# EasyEDA Pro project ProiectPM.eprj

# Schematic Schematic1
Board Name: Board1; Create Date: 2025-12-15; Page Name: P1; Project Name: ProiectPM; Schematic Name: Schematic1; Update Date: 2025-12-18; Company: EasyEDA.com; Page Size: A4; Version: V1.0
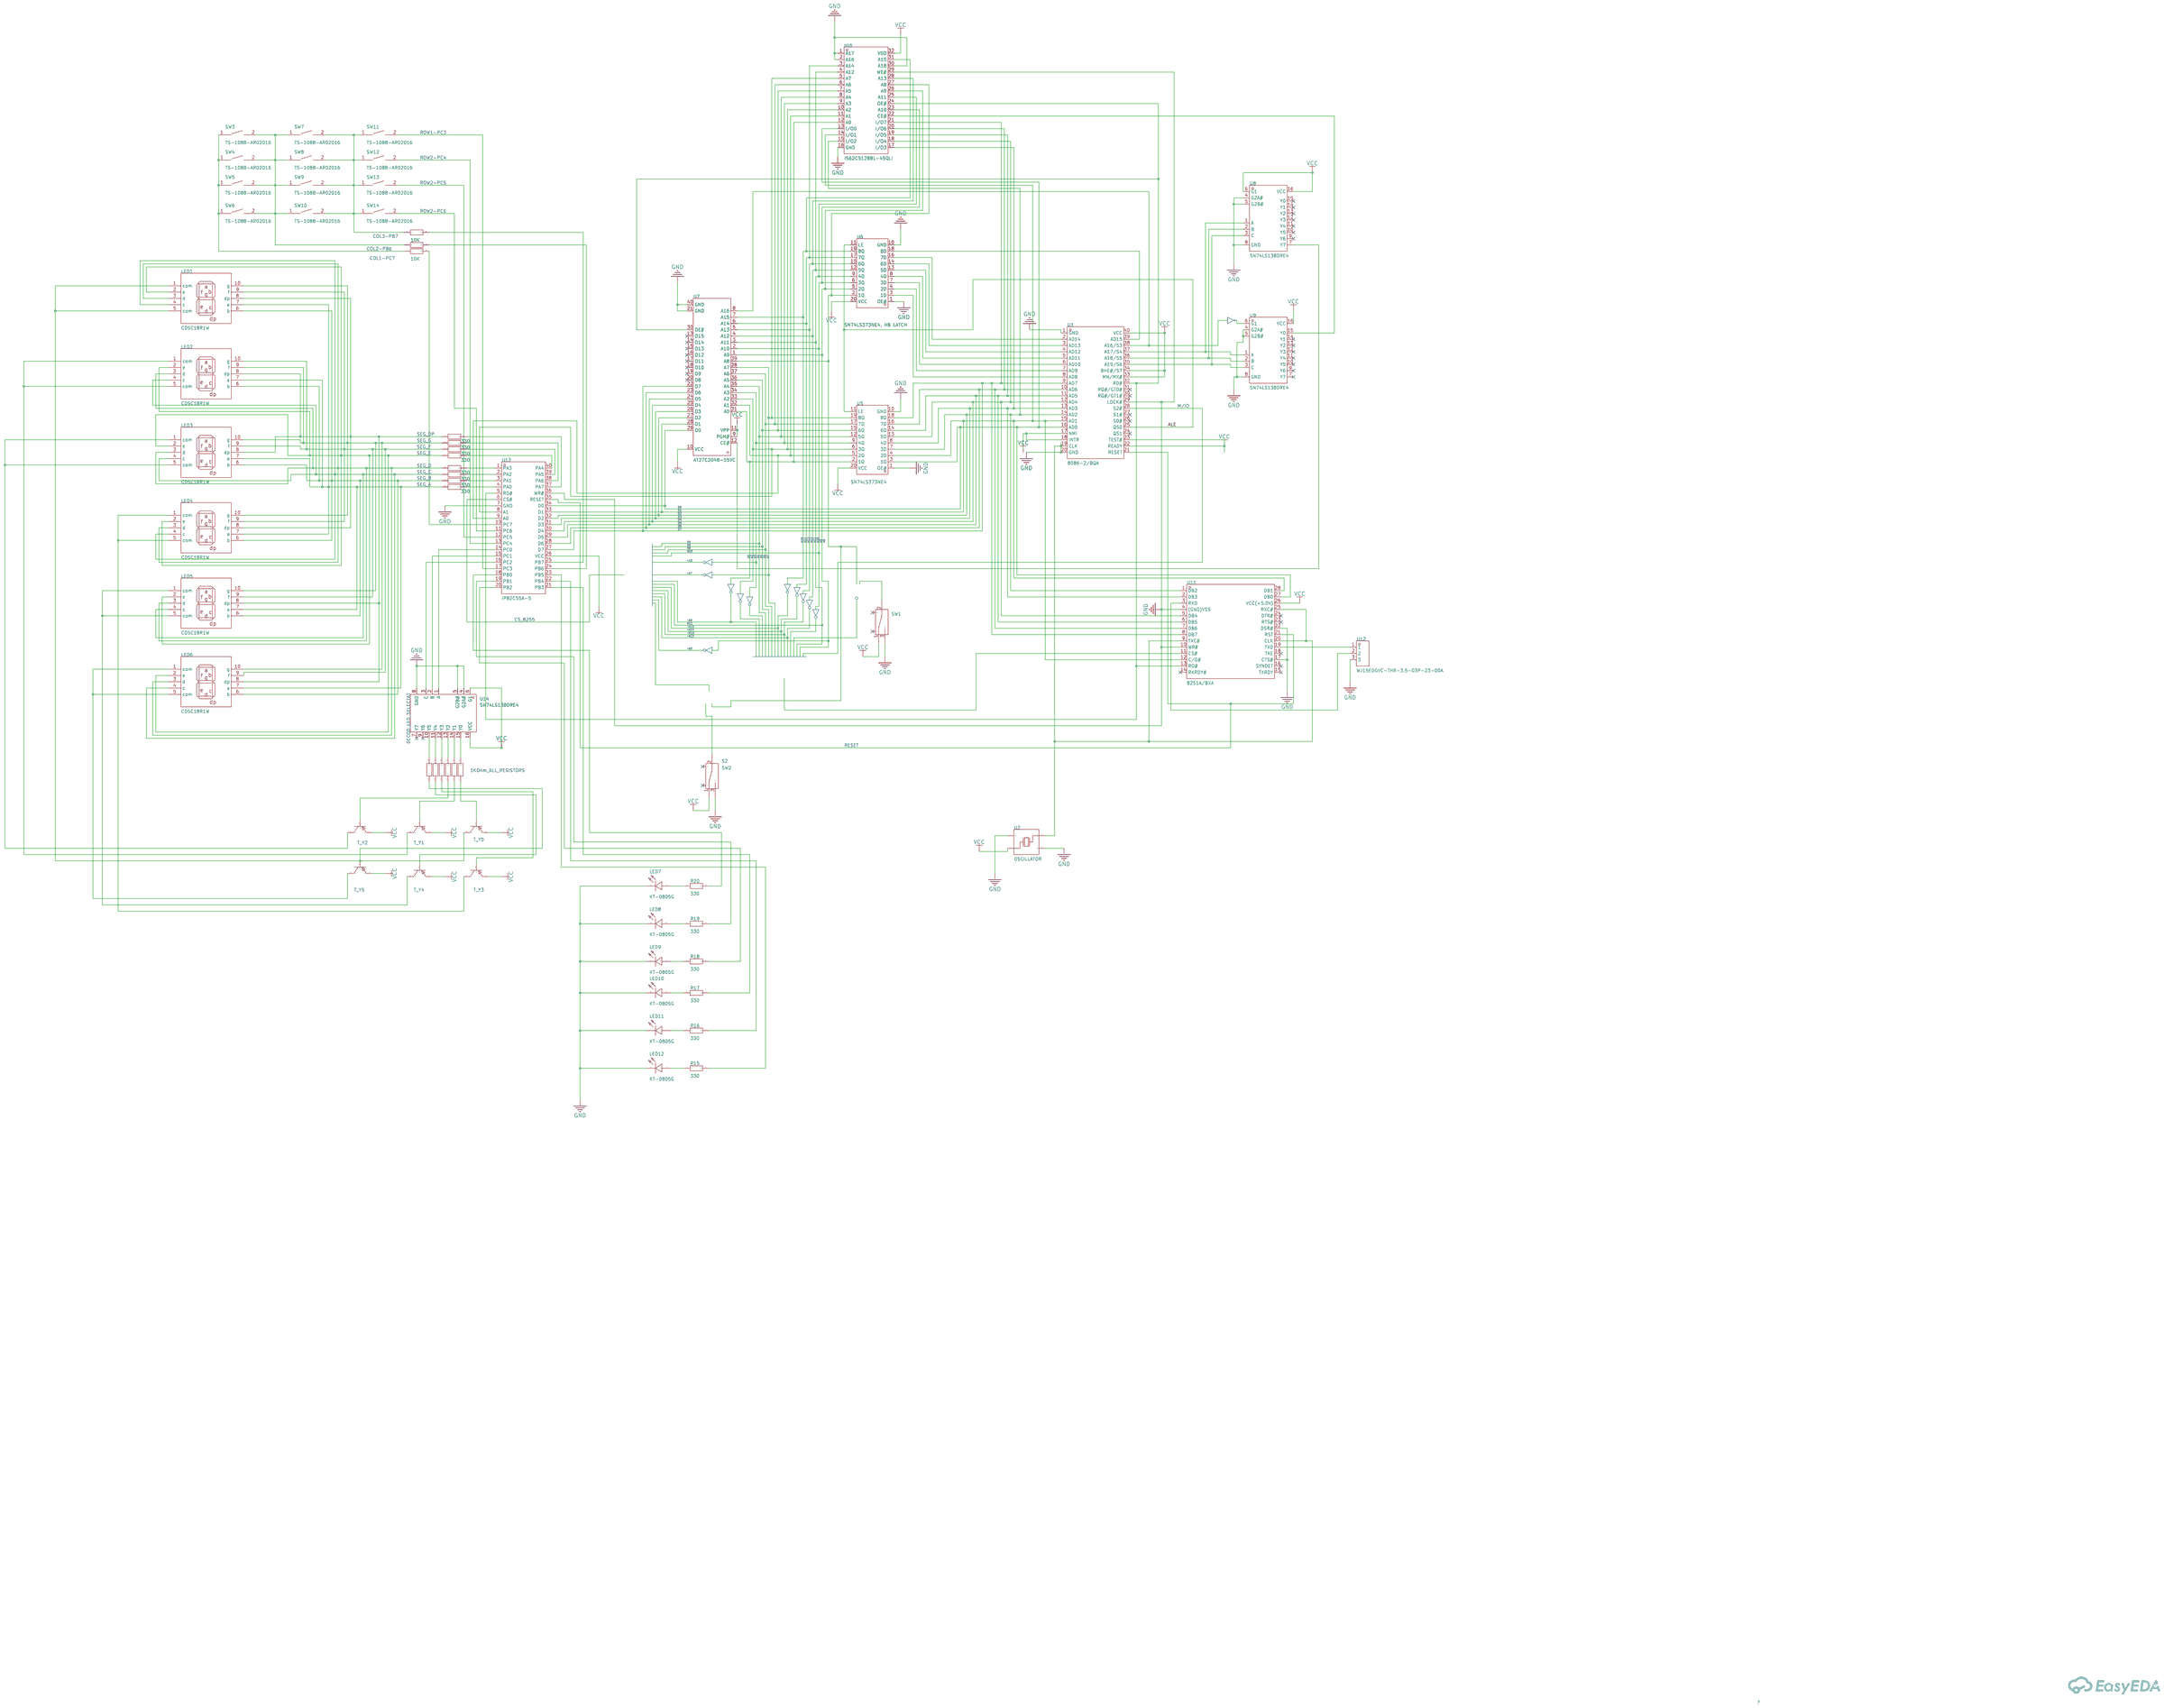
[diagram p0: schematic sheet]

## Parts
LED1  CDSC18R1W  [LED-SEG-TH_10P-L56.0-W38.0-P2.54]
LED2  CDSC18R1W  [LED-SEG-TH_10P-L56.0-W38.0-P2.54]
LED3  CDSC18R1W  [LED-SEG-TH_10P-L56.0-W38.0-P2.54]
LED4  CDSC18R1W  [LED-SEG-TH_10P-L56.0-W38.0-P2.54]
LED5  CDSC18R1W  [LED-SEG-TH_10P-L56.0-W38.0-P2.54]
LED6  CDSC18R1W  [LED-SEG-TH_10P-L56.0-W38.0-P2.54]
LED7  KT-0805G  [LED0805-R-RD]
LED8  KT-0805G  [LED0805-R-RD]
LED9  KT-0805G  [LED0805-R-RD]
LED10  KT-0805G  [LED0805-R-RD]
LED11  KT-0805G  [LED0805-R-RD]
LED12  KT-0805G  [LED0805-R-RD]
Q1  PNP3916  [SOT-23-3_L2.9-W1.3-P0.95-LS2.4-BR]
Q2  PNP3916  [SOT-23-3_L2.9-W1.3-P0.95-LS2.4-BR]
Q3  PNP3916  [SOT-23-3_L2.9-W1.3-P0.95-LS2.4-BR]
Q4  PNP3916  [SOT-23-3_L2.9-W1.3-P0.95-LS2.4-BR]
Q5  PNP3916  [SOT-23-3_L2.9-W1.3-P0.95-LS2.4-BR]
Q6  PNP3916  [SOT-23-3_L2.9-W1.3-P0.95-LS2.4-BR]
R1  330  [R0603]
R2  330  [R0603]
R3  330  [R0603]
R4  330  [R0603]
R5  330  [R0603]
R6  330  [R0603]
R7  330  [R0603]
R8  330  [R0603]
R9  1K  [R0603]
R10  1K  [R0603]
R11  1K  [R0603]
R12  1K  [R0603]
R13  1K  [R0603]
R14  1K  [R0603]
R15  330  [R0603]
R16  330  [R0603]
R17  330  [R0603]
R18  330  [R0603]
R19  330  [R0603]
R20  330  [R0603]
R21  10K  [R0603]
R22  10K  [R0603]
R23  10K  [R0603]
SW1  -  [SW-TH_SK12D07VG3]
SW2  -  [SW-TH_SK12D07VG3]
SW3  TS-1088-AR02016  [SW-SMD_L3.9-W3.0-P4.45]
SW4  TS-1088-AR02016  [SW-SMD_L3.9-W3.0-P4.45]
SW5  TS-1088-AR02016  [SW-SMD_L3.9-W3.0-P4.45]
SW6  TS-1088-AR02016  [SW-SMD_L3.9-W3.0-P4.45]
SW7  TS-1088-AR02016  [SW-SMD_L3.9-W3.0-P4.45]
SW8  TS-1088-AR02016  [SW-SMD_L3.9-W3.0-P4.45]
SW9  TS-1088-AR02016  [SW-SMD_L3.9-W3.0-P4.45]
SW10  TS-1088-AR02016  [SW-SMD_L3.9-W3.0-P4.45]
SW11  TS-1088-AR02016  [SW-SMD_L3.9-W3.0-P4.45]
SW12  TS-1088-AR02016  [SW-SMD_L3.9-W3.0-P4.45]
SW13  TS-1088-AR02016  [SW-SMD_L3.9-W3.0-P4.45]
SW14  TS-1088-AR02016  [SW-SMD_L3.9-W3.0-P4.45]
U1  8086-2/BQA  [PDIP-40_L52.3-W13.8-P2.54-LS15.2-BL]
U2  OSCILLATOR  [CRYSTAL-SMD_4P-L2.0-W1.6-BL-B]
U5  SN74LS373NE4  [PDIP-20_L25.9-W6.6-P2.54-LS7.9-BL]
U6  SN74LS373NE4, HB LATCH  [PDIP-20_L25.9-W6.6-P2.54-LS7.9-BL]
U7  AT27C2048-55VC  [TSOP-40_L12.4-W10.0-P0.50-LS14.0-BL]
U8  SN74LS138DRE4  [SOIC-16_L9.9-W3.9-P1.27-LS6.0-BL]
U9  SN74LS138DRE4  [SOIC-16_L9.9-W3.9-P1.27-LS6.0-BL]
U10  IS62C5128BL-45QLI  [SOP-32_L20.7-W11.3-P1.27-LS14.1-BL]
U11  8251A/BXA  [PDIP-28_L35.0-W7.3-P2.54-LS7.8-BL]
U12  WJ15EDGVC-THR-3.5-03P-23-00A  [CONN-TH_3P-P3.50_WJ15EDGVC-THR-3.5-03P-23-00A]
U13  IP82C55A-5  [PDIP-40_L51.8-W13.5-P2.54-LS15.4-BL]
U14  SN74LS138DRE4  [SOIC-16_L9.9-W3.9-P1.27-LS6.0-BL]

## Library data of the parts
LED1-LED6 = CDSC18R1W: Number of Characters:1 Display Type:7 Segment Digit/Alpha Size(inch):1.8 Pd - Power Dissipation:75mW Illumination Color:Red LED Polarity:Common Cathode; Supplier Part: C6479561; Manufacturer: ChromeLED; Supplier Footprint: DIP-10; JLCPCB Part Class: Extended Part; Datasheet: https://item.szlcsc.com/datasheet/CDSC18R1W/7432727.html; Supplier: LCSC; Number of Characters: 1; Display Type: 7 Segment; Digit/Alpha Size(inch): 1.8; Pd - Power Dissipation: 75mW; Illumination Color: Red; LED Polarity: Common Cathode
LED7-LED12 = KT-0805G: Lamp Holder Type:- Illumination Color:Emerald Green Voltage - Forward(Vf):2.6V~3.1V Voltage - Forward(Vf):2.6V~3.1V Power(Watts):100mW Forward Current:5mA Wavelength - Dominant:513nm~528nm Wavelength - Dominant:513nm~528nm Peak Wavelength:525nm Diode Conf; LCSC Part Name: 0805 翠绿 高亮; Supplier Part: C2297; Manufacturer: KENTO; Supplier Footprint: 0805; JLCPCB Part Class: Basic Part; Datasheet: https://item.szlcsc.com/datasheet/KT-0805G/2670.html; Supplier: LCSC; Illumination Color: Emerald Green; Voltage - Forward(Vf): 2.6V~3.1V; Power(Watts): 100mW; Forward Current: 5mA; Wavelength - Dominant: 513nm~528nm; Peak Wavelength: 525nm; Luminous Intensity: 430mcd; Viewing Angle: 120°; Operating Temperature: -40℃~+85℃
Q1-Q6 = PNP3916: Supplier Part: C9900016265; Supplier Footprint: SOT-23; JLCPCB Part Class: Extended Part; Supplier: LCSC
R1-R23 = Res_0603: Supplier Footprint: 0603
SW1 SW2 = SK12D07VG3: Supplier Footprint: Through
SW3-SW14 = TS-1088-AR02016: Circuit:SPST Actuator Style:Round Button Operating Force:1.6N Mounting Type:Surface Mount,Vertical Length:4mm Width:3mm Switch Height:2mm with Bracket:Without Bracket Contact Current:50mA Voltage Rating:12V Actuator/Cap Color:Black Termination Style:SMD(S; LCSC Part Name: 4*3*2mm 立贴 轻触开关; Supplier Part: C720477; Manufacturer: XUNPU(讯普); Supplier Footprint: SMD,4x3mm; JLCPCB Part Class: Basic Part; Datasheet: https://item.szlcsc.com/datasheet/TS-1088-AR02016/763484.html; Supplier: LCSC; Circuit: SPST; Actuator Style: Round Button; Operating Force: 1.6N; Mounting Type: Surface Mount,Vertical; Length: 4mm; Width: 3mm; Switch Height: 2mm; with Bracket: Without Bracket; Contact Current: 50mA; Voltage Rating: 12V; Actuator/Cap Color: Black; Termination Style: SMD(SMT) Tab; Life: 100,000 Cycles; Operating Temperature: -30℃~+80℃
U1 = 8086-2/BQA: CPU Core:- CPU Maximum Speed:8MHz Operating Temperature Range:-55℃~+125℃ Operating Temperature Range:-55℃~+125℃; Supplier Part: C3229526; Manufacturer: AMD(超微); Supplier Footprint: CDIP-40; JLCPCB Part Class: Extended Part; Datasheet: https://atta.szlcsc.com/upload/public/pdf/source/20240402/FE35119881CB502F4EE6944C35A1E6D9.pdf; Supplier: LCSC; CPU Maximum Speed: 8MHz; Operating Temperature Range: -55℃~+125℃
U2 = OSCILLATOR: Supplier Part: C9900111369; Supplier Footprint: SMD2016-4P; JLCPCB Part Class: Extended Part; Supplier: LCSC
U5 U6 = SN74LS373NE4: Supplier Part: C20345770; Manufacturer: TI(德州仪器); Supplier Footprint: PDIP-20; JLCPCB Part Class: Extended Part; Datasheet: https://item.szlcsc.com/datasheet/SN74LS373NE4/21671297.html; Supplier: LCSC
U7 = AT27C2048-55VC: Supplier Part: C19423625; Manufacturer: MICROCHIP(美国微芯); Supplier Footprint: VSOP-40; JLCPCB Part Class: Extended Part; Datasheet: https://atta.szlcsc.com/upload/public/pdf/source/20231219/0DD6148A7C9B4172B7CA1C9A8834C9C9.pdf; Supplier: LCSC
U8 U9 U14 = SN74LS138DRE4: Supplier Part: C21427068; Manufacturer: TI(德州仪器); Supplier: LCSC
U10 = IS62C5128BL-45QLI: LCSC Part Name: IS62C5128BL 45QLI; Supplier Part: C1353472; Manufacturer: ISSI(美国芯成); Supplier Footprint: SOP-32-11.3mm; JLCPCB Part Class: Extended Part; Datasheet: https://item.szlcsc.com/datasheet/IS62C5128BL-45QLI/1443757.html; Supplier: LCSC
U11 = 8251A/BXA: Supplier Part: C3228905; Manufacturer: Rochester Electronics(罗彻斯特); JLCPCB Part Class: Extended Part; Supplier: LCSC
U12 = WJ15EDGVC-THR-3.5-03P-23-00A: Supplier Part: C9900098328; Supplier Footprint: connector; JLCPCB Part Class: Extended Part; Supplier: LCSC
U13 = IP82C55A-5: Number of I/O:24 Interrupt Output:- Output Type: Supply Voltage:4.5V~5.5V Supply Voltage:4.5V~5.5V Output Source current:- Output Sink Current:- Clock Frequency:8MHz Operating Temperature:-40℃~+85℃ Operating Temperature:-40℃~+85℃; LCSC Part Name: 82C55A CMOS可编程外设接口; Supplier Part: C3191431; Manufacturer: HARRIS(哈利斯); Supplier Footprint: PDIP-40; JLCPCB Part Class: Extended Part; Datasheet: https://atta.szlcsc.com/upload/public/pdf/source/20240129/96FE76EECB88ABABB4E57A2587E9A442.pdf; Supplier: LCSC; Number of I/O: 24; Supply Voltage: 4.5V~5.5V; Clock Frequency: 8MHz; Operating Temperature: -40℃~+85℃

## Nets
GND: LED7.2(K) LED8.2(K) LED9.2(K) LED10.2(K) LED11.2(K) LED12.2(K) SW1.3 SW2.3 U1.1(GND) U1.19(CLK) U1.20(GND) U1.29(LOCK#) U2.2(GND) U2.3(OSC2) U2.4(GND) U5.1(OE#) U5.10(GND) U6.1(OE#) U6.10(GND) U7.21(GND) U7.40(GND) U8.4(G2A#) U8.5(G2B#) U8.8(GND) U9.4(G2A#) U9.5(G2B#) U9.8(GND) U10.1(A17) U10.2(A16) U10.16(GND) U10.29(WE#) U10.30(A18) U11.4((GND)VSS) U11.9(TXC#) U11.10(WR#) U11.17(CTS#) U11.20(CLK) U11.22(DSR#) U11.25(RXC#) U12.3 U13.7(GND) U13.36(WR#) U14.4(G2A#) U14.5(G2B#) U14.8(GND)
VCC: Q1.2(E) Q2.2(E) Q3.2(E) Q4.2(E) Q5.2(E) Q6.2(E) SW1.1 SW2.1 U1.17(NMI) U1.18(INTR) U1.22(READY) U1.23(TEST#) U1.33(MN/MX#) U1.34(BHE#/S7) U1.40(VCC) U2.1(OSC1) U5.20(VCC) U6.20(VCC) U7.9(PGM#) U7.10(VCC) U7.11(VPP) U8.6(G1) U8.16(VCC) U9.16(VCC) U10.32(VDD) U11.26(VCC(+5.0V)) U13.26(VCC) U14.6(G1) U14.16(VCC)
ALE: U1.25(QS0) U5.11(LE) U6.11(LE)
Net-(LED1-1): LED1.1(com) LED1.5(com) Q1.3(C) Q6.1(B) R14.1
Net-(LED1-2): LED1.2(e) LED2.2(e) LED3.2(e) LED4.2(e) LED5.2(e) LED6.2(e) R5.1
Net-(LED1-3): LED1.3(d) LED2.3(d) LED3.3(d) LED4.3(d) LED5.3(d) LED6.3(d) R4.1
Net-(LED1-4): LED1.4(c) LED2.4(c) LED3.4(c) LED4.4(c) LED5.4(c) LED6.4(c) R3.1
Net-(LED1-6): LED1.6(b) LED2.6(b) LED3.6(b) LED4.6(b) LED5.6(b) LED6.6(b) R2.1
Net-(LED1-7): LED1.7(a) LED2.7(a) LED3.7(a) LED4.7(a) LED5.7(a) LED6.7(a) R1.1
Net-(LED1-8): LED1.8(dp) LED2.8(dp) LED3.8(dp) LED4.8(dp) LED5.8(dp) LED6.8(dp) R8.1
Net-(LED1-9): LED1.9(f) LED2.10(g) LED3.9(f) LED4.9(f) LED5.9(f) LED6.9(f) R6.1
Net-(LED1-10): LED1.10(g) LED2.9(f) LED3.10(g) LED4.10(g) LED5.10(g) LED6.10(g) R7.1
Net-(LED2-1): LED2.1(com) LED2.5(com) Q2.3(C)
Net-(LED3-1): LED3.1(com) LED3.5(com) Q3.3(C)
Net-(LED4-1): LED4.1(com) LED4.5(com) Q4.3(C)
Net-(LED5-1): LED5.1(com) LED5.5(com) Q5.3(C)
Net-(LED6-1): LED6.1(com) LED6.5(com) Q6.3(C)
Net-(LED7-1): LED7.1(A) R20.1
Net-(LED8-1): LED8.1(A) R19.1
Net-(LED9-1): LED9.1(A) R18.1
Net-(LED10-1): LED10.1(A) R17.1
Net-(LED11-1): LED11.1(A) R16.1
Net-(LED12-1): LED12.1(A) R15.1
Net-(Q1-1): Q1.1(B) R9.1
Net-(Q2-1): Q2.1(B) R10.1
Net-(Q3-1): Q3.1(B) R11.1
Net-(Q4-1): Q4.1(B) R12.1
Net-(Q5-1): Q5.1(B) R13.1
Net-(R1-2): R1.2 U13.4(PA0)
Net-(R2-2): R2.2 U13.3(PA1)
Net-(R3-2): R3.2 U13.2(PA2)
Net-(R4-2): R4.2 U13.1(PA3)
Net-(R5-2): R5.2 U13.40(PA4)
Net-(R6-2): R6.2 U13.39(PA5)
Net-(R7-2): R7.2 U13.38(PA6)
Net-(R8-2): R8.2 U13.37(PA7)
Net-(R9-2): R9.2 U14.15(Y0)
Net-(R10-2): R10.2 U14.14(Y1)
Net-(R11-2): R11.2 U14.13(Y2)
Net-(R12-2): R12.2 U14.12(Y3)
Net-(R13-2): R13.2 U14.11(Y4)
Net-(R14-2): R14.2 U14.10(Y5)
Net-(R15-2): R15.2 U13.23(PB5)
Net-(R16-2): R16.2 U13.22(PB4)
Net-(R17-2): R17.2 U13.21(PB3)
Net-(R18-2): R18.2 U13.20(PB2)
Net-(R19-2): R19.2 U13.19(PB1)
Net-(R20-2): R20.2 U13.18(PB0)
Net-(R21-1): R21.1 SW7.2 SW8.2 SW9.2 SW10.2 SW11.1 SW12.1 SW13.1 SW14.1
Net-(R21-2): R21.2 U13.25(PB7)
Net-(R22-1): R22.1 SW3.2 SW4.2 SW5.2 SW6.2 SW7.1 SW8.1 SW9.1 SW10.1
Net-(R22-2): R22.2 U13.24(PB6)
Net-(R23-1): R23.1 SW3.1 SW4.1 SW5.1 SW6.1
Net-(R23-2): R23.2 U13.10(PC7)
Net-(SW11-2): SW11.2 U13.17(PC3)
Net-(SW12-2): SW12.2 U13.13(PC4)
Net-(SW13-2): SW13.2 U13.12(PC5)
Net-(SW14-2): SW14.2 U13.11(PC6)
Net-(U1-2): U1.2(AD14) U6.16(7D)
Net-(U1-3): U1.3(AD13) U6.14(6D)
Net-(U1-4): U1.4(AD12) U6.13(5D)
Net-(U1-5): U1.5(AD11) U6.8(4D)
Net-(U1-6): U1.6(AD10) U6.7(3D)
Net-(U1-7): U1.7(AD9) U6.4(2D)
Net-(U1-8): U1.8(AD8) U6.3(1D)
Net-(U1-9): U1.9(AD7) U5.18(8D) U7.22(O7) U10.21(I/O7) U11.8(DB7) U13.27(D7)
Net-(U1-10): U1.10(AD6) U5.16(7D) U7.23(O6) U10.20(I/O6) U11.7(DB6) U13.28(D6)
Net-(U1-11): U1.11(AD5) U5.14(6D) U7.24(O5) U10.19(I/O5) U11.6(DB5) U13.29(D5)
Net-(U1-12): U1.12(AD4) U5.13(5D) U7.25(O4) U10.18(I/O4) U11.5(DB4) U13.30(D4)
Net-(U1-13): U1.13(AD3) U5.8(4D) U7.26(O3) U10.17(I/O3) U11.2(DB3) U13.31(D3)
Net-(U1-14): U1.14(AD2) U5.7(3D) U7.27(O2) U10.15(I/O2) U11.1(DB2) U13.32(D2)
Net-(U1-15): U1.15(AD1) U5.4(2D) U7.28(O1) U10.14(I/O1) U11.12(C/D#) U11.28(DB1) U13.33(D1)
Net-(U1-16): U1.16(AD0) U5.3(1D) U7.29(O0) U10.13(I/O0) U11.27(DB0) U13.34(D0)
Net-(U1-21): U1.21(RESET) U11.21(RST) U13.35(RESET)
Net-(U1-32): U1.32(RD#) U7.30(OE#) U10.24(OE#) U11.13(RO#) U13.5(RD#)
Net-(U1-35): U1.35(A19/S6) U8.3(C) U9.3(C)
Net-(U1-36): U1.36(A18/S5) U8.2(B) U9.2(B)
Net-(U1-37): U1.37(A17/S4) U8.1(A) U9.1(A)
Net-(U1-38): U1.38(A16/S3) U7.8(A16)
Net-(U1-39): U1.39(AD15) U6.18(8D)
Net-(U5-2): U5.2(1Q) U7.31(A0) U10.12(A0)
Net-(U5-5): U5.5(2Q) U7.32(A1) U10.11(A1) U13.9(A0)
Net-(U5-6): U5.6(3Q) U7.33(A2) U10.10(A2) U13.8(A1)
Net-(U5-9): U5.9(4Q) U7.34(A3) U10.9(A3)
Net-(U5-12): U5.12(5Q) U7.35(A4) U10.8(A4)
Net-(U5-15): U5.15(6Q) U7.36(A5) U10.7(A5)
Net-(U5-17): U5.17(7Q) U7.37(A6) U10.6(A6)
Net-(U5-19): U5.19(8Q) U7.38(A7) U10.5(A7)
Net-(U6-2): U6.2(1Q) U7.39(A8) U10.27(A8)
Net-(U6-5): U6.5(2Q) U7.1(A9) U10.26(A9)
Net-(U6-6): U6.6(3Q) U7.2(A10) U10.23(A10)
Net-(U6-9): U6.9(4Q) U7.3(A11) U10.25(A11)
Net-(U6-12): U6.12(5Q) U7.4(A12) U10.4(A12)
Net-(U6-15): U6.15(6Q) U7.5(A13) U10.28(A13)
Net-(U6-17): U6.17(7Q) U7.6(A14) U10.3(A14)
Net-(U6-19): U6.19(8Q) U7.7(A15) U10.31(A15)
Net-(U7-12): U7.12(CE#) U8.7(Y7)
Net-(U9-15): U9.15(Y0) U10.22(CE#)
Net-(U11-3): U11.3(RXD) U12.2
Net-(U11-19): U11.19(TXD) U12.1
Net-(U13-14): U13.14(PC0) U14.1(A)
Net-(U13-15): U13.15(PC1) U14.2(B)
Net-(U13-16): U13.16(PC2) U14.3(C)

Not connected (* = marked no-connect by the designer): SW1 2 4* 5*; SW2 2 4* 5*; U1 24(QS1)* 26(S0#)* 27(S1#)* 28(S2#) 30(RQ#/GT1#)* 31(RQ#/GT0#)*; U7 13(O15)* 14(O14)* 15(O13)* 16(O12)* 17(O11)* 18(O10)* 19(O9)* 20(O8)*; U8 9(Y6)* 10(Y5)* 11(Y4)* 12(Y3)* 13(Y2)* 14(Y1)* 15(Y0)*; U9 6(G1) 7(Y7)* 9(Y6)* 10(Y5)* 11(Y4)* 12(Y3)* 13(Y2)* 14(Y1)*; U11 11(CS#) 14(RXRDY#)* 15(TXRDY)* 16(SYNDET)* 18(TXE)* 23(RTS#)* 24(DTR#)*; U13 6(CS#); U14 7(Y7)* 9(Y6)*

## Notes on the sheet
- ROW1-PC3
- ROW2-PC4
- ROW2-PC5
- ROW2-PC6
- COL3-PB7
- COL2-PB6
- COL1-PC7
- M/IO
- SEG_DP
- SEG_G
- SEG_F
- SEG_E
- SEG_D
- SEG_C
- SEG_A
- SEG_B
- D0
- D1
- D2
- D3
- D4
- D5
- D6
- D7
- A4
- A5
- A15
- A14
- A13
- A12
- A11
- A10
- A9
- A8
- A10
- A6
- A0
- A2
- A3
- A4
- A5
- A6
- A7
- ~A3
- ~A7
- CS_8255
- A11
- ~A0
- ~A15
- ~A13
- ~A14
- ~A12
- ~A9
- DECOD_LED_SELECTAT
- RESET
- S2
- 1KOhm_ALL_RESISTORS
- T_Y0
- T_Y2
- T_Y1
- T_Y5
- T_Y4
- T_Y3
